# EAGLE design jpwr.v1 (EAGLE 6.2)
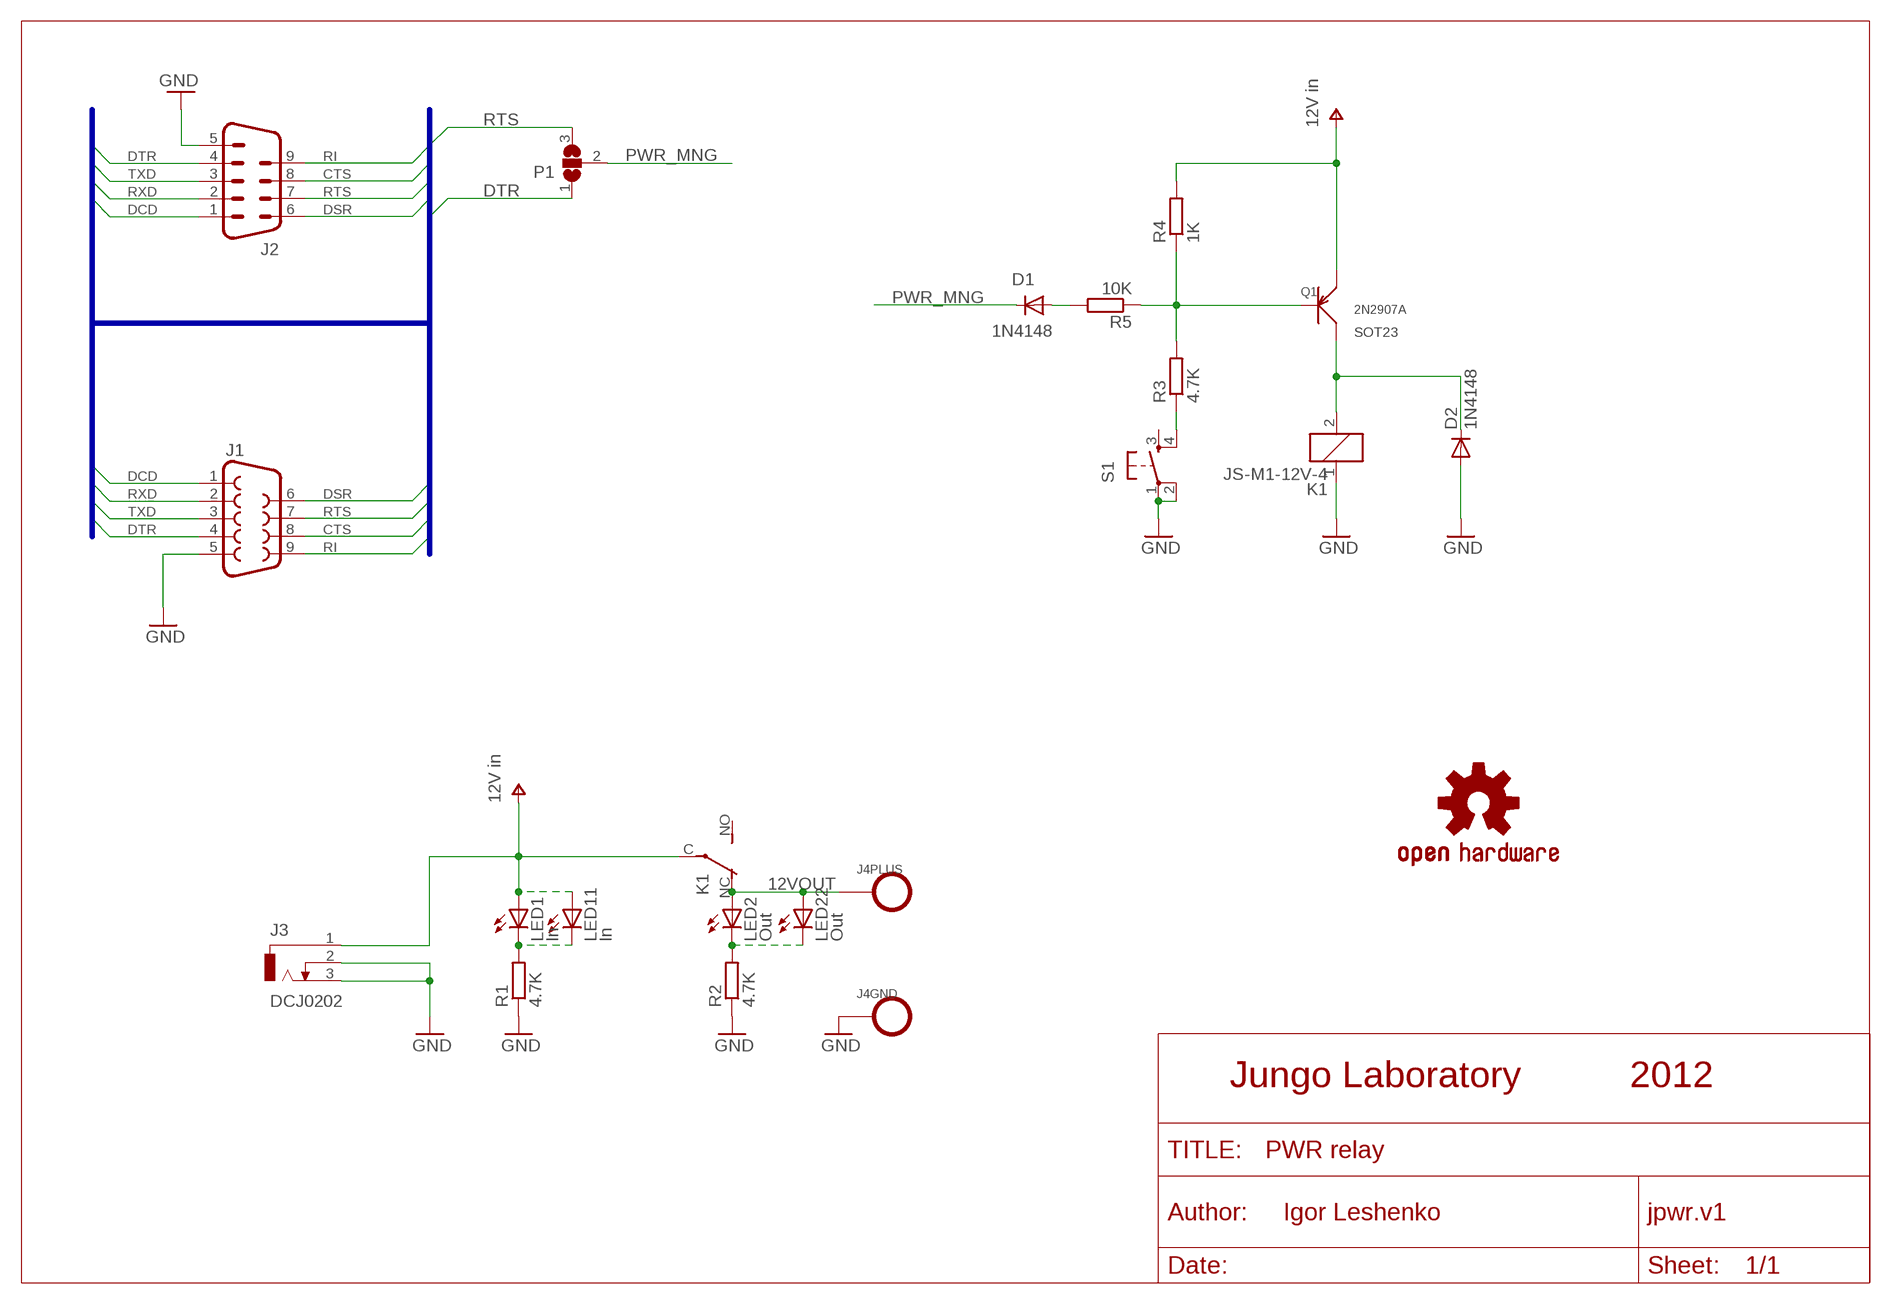
[diagram p0: schematic, sheet 1]

## Parts
D1  1N4148  DIODE-SOD123  [SOD123]
D2  1N4148  DIODE-SOD123  [SOD123]
J1  F09D  [F09D]
J2  M09D  [M09D]
J3  DCJ0202  [DCJ0202]
J4  POWER-OUT  [FLEX-POWER]
K1  JS-M1-12V-4  [SRD]
LED1  In  LEDCHIP-LED0805  [CHIP-LED0805]
LED2  Out  LEDCHIP-LED0805  [CHIP-LED0805]
LED11  In  LEDCHIP-LED0805  [CHIP-LED0805]
LED22  Out  LEDCHIP-LED0805  [CHIP-LED0805]
P1  PAD-SOLDERJUMPER-2WAYT  [3P-SMD-4.8X2]
Q1  2N2907A  TRANSISTOR-PNP-SOT23  [SOT23]
R1  4.7K  R-EU_M0805  [M0805]
R2  4.7K  R-EU_M0805  [M0805]
R3  4.7K  R-EU_M0805  [M0805]
R4  1K  R-EU_M0805  [M0805]
R5  10K  R-EU_M0805  [M0805]
S1  TAC_SWITCHPTH  [TACTILE-PTH]
U$1  OSHW-LOGOL  [OSHW-LOGO-L]

## Nets
12VOUT [power]: J4.1 K1.NC(2:O) LED2.A LED22.A
+12V [power]: J3.1 K1.C(2:P) LED1.A LED11.A Q1.2(E) R4.2 ; supply symbol labelled 12V in
CTS [wires]: J1.8 J2.8
DCD [wires]: J1.1 J2.1
DSR [wires]: J1.6 J2.6
DTR: J1.4 J2.4 P1.1
GND [power]: D2.A J1.5 J2.5 J3.2 J3.3 J4.2 K1.1 R1.1 R2.1 S1.1 S1.2
N$1: R3.1 S1.4
N$8: LED1.C LED11.C R1.2
N$9: LED2.C LED22.C R2.2
N$13: D1.A R5.2
PWR_MNG: D1.C P1.2
Q1_B: Q1.1(B) R3.2 R4.1 R5.1
Q1_C: D2.C K1.2 Q1.3(C)
RI [wires]: J1.9 J2.9
RTS: J1.7 J2.7 P1.3
RXD: J1.2 J2.2
TXD: J1.3 J2.3
Unconnected: K1.NO(2:S) S1.3

## Buses
DCD,RXD,TXD,DTR,DSR,RTS,CTS,RI

## Notes on the sheet
- SOT23
- 2012
- PWR relay
- Igor Leshenko

## Library data of the parts
D1 D2 = diode:DIODE-: DIODE
J1 = con-subd:F09: SUB-D; OC_FARNELL: unknown; OC_NEWARK: unknown
J2 = jlab:M09: SUB-D; OC_FARNELL: unknown; OC_NEWARK: unknown
J3 = con-jack:DCJ0202: DC POWER JACK Source: DCJ0202.pdf; OC_FARNELL: unknown; OC_NEWARK: unknown
J4 = jlab:POWER-OUT
K1 = jlab:JS-M1*: SRD power relayy Source: http://www.spb-planeta.ru/pdf/srd.pdf; MPN: JSM1-12V-4; OC_FARNELL: 910338; OC_NEWARK: 13P4552
LED1 LED2 LED11 LED22 = jlab:LED: LED OSRAM: - CHIPLED LG R971, LG N971, LY N971, LG Q971, LY Q971, LO R971, LY R971 LH N974, LH R974 LS Q976, LO Q976, LY Q976 LO Q996 - Hyper CHIPLED LW Q18S LB Q993, LB Q99A, LB R99A - SideLED LS A670, LO A670, LY A670, LG A670, LP A670 LB A673, LV A673, LT A673, LW A673 LH A674 LY A675 LS A676, LA A676, LO A676, LY A676, LW A676 LS A679, LY A679, LG A679 - Hyper Micro SIDELED® LS Y876, LA Y876, LO Y876, LY Y876 LT Y87S - SmartLED LW L88C, LW L88S LB L89C, LB L89S, LG L890 LS L89K, LO L89K, LY L89K LS L896, LA L896, LO L896, LY L896 - TOPLED LS T670, LO T670, LY T670, LG T670, LP T670 LSG T670, LSP T670, LSY T670, LOP T670, LYG T670 LG T671, LOG T671, LSG T671 LB T673, LV T673, LT T673, LW T673 LH T674 LS T676, LA T676, LO T676, LY T676, LB T676, LH T676, LSB T676, LW T676 LB T67C, LV T67C, LT T67C, LS T67K, LO T67K, LY T67K, LW E67C LS E67B, LA E67B, LO E67B, LY E67B, LB E67C, LV E67C, LT E67C LW T67C LS T679, LY T679, LG T679 LS T770, LO T770, LY T770, LG T770, LP T770 LB T773, LV T773, LT T773, LW T773 LH T774 LS E675, LA E675, LY E675, LS T675 LS T776, LA T776, LO T776, LY T776, LB T776 LHGB T686 LT T68C, LB T68C - Hyper Mini TOPLED® LB M676 - Mini TOPLED Santana® LG M470 LS M47K, LO M47K, LY M47K Source: http://www.osram.convergy.de LUXEON: - LUMILED® LXK2-PW12-R00, LXK2-PW12-S00, LXK2-PW14-U00, LXK2-PW14-V00 LXK2-PM12-R00, LXK2-PM12-S00, LXK2-PM14-U00 LXK2-PE12-Q00, LXK2-PE12-R00, LXK2-PE12-S00, LXK2-PE14-T00, LXK2-PE14-U00 LXK2-PB12-K00, LXK2-PB12-L00, LXK2-PB12-M00, LXK2-PB14-N00, LXK2-PB14-P00, LXK2-PB14-Q00 LXK2-PR12-L00, LXK2-PR12-M00, LXK2-PR14-Q00, LXK2-PR14-R00 LXK2-PD12-Q00, LXK2-PD12-R00, LXK2-PD12-S00 LXK2-PH12-R00, LXK2-PH12-S00 LXK2-PL12-P00, LXK2-PL12-Q00, LXK2-PL12-R00 Source: www.luxeon.com KINGBRIGHT: KA-3528ASYC Source: www.kingbright.com
P1 = Discrete:PAD-SOLDERJUMPER-2WAY: Solder Jumper 2 way solder jumper
Q1 = Discrete:TRANSISTOR-PNP*: PNP audion
R1-R5 = rcl:R-EU_: RESISTOR, European symbol
S1 = SparkFun:TAC_SWITCH: Momentary Switch Button commonly used for reset or general input. Spark Fun Electronics SKU : COM-00097
U$1 = SparkFun:OSHW-LOGO: Open Source Hardware Logo This logo indicates the piece of hardware it is found on incorporates a OSHW license and/or adheres to the definition of open source hardware found here: http://freedomdefined.org/OSHW

## Net classes
0 default: width 0.254 mm, drill 0.5 mm, clearance 0.254 mm
1 power: width 0.813 mm, clearance 0.406 mm
2 wires: width 0.254 mm, clearance 0.254 mm

## Board
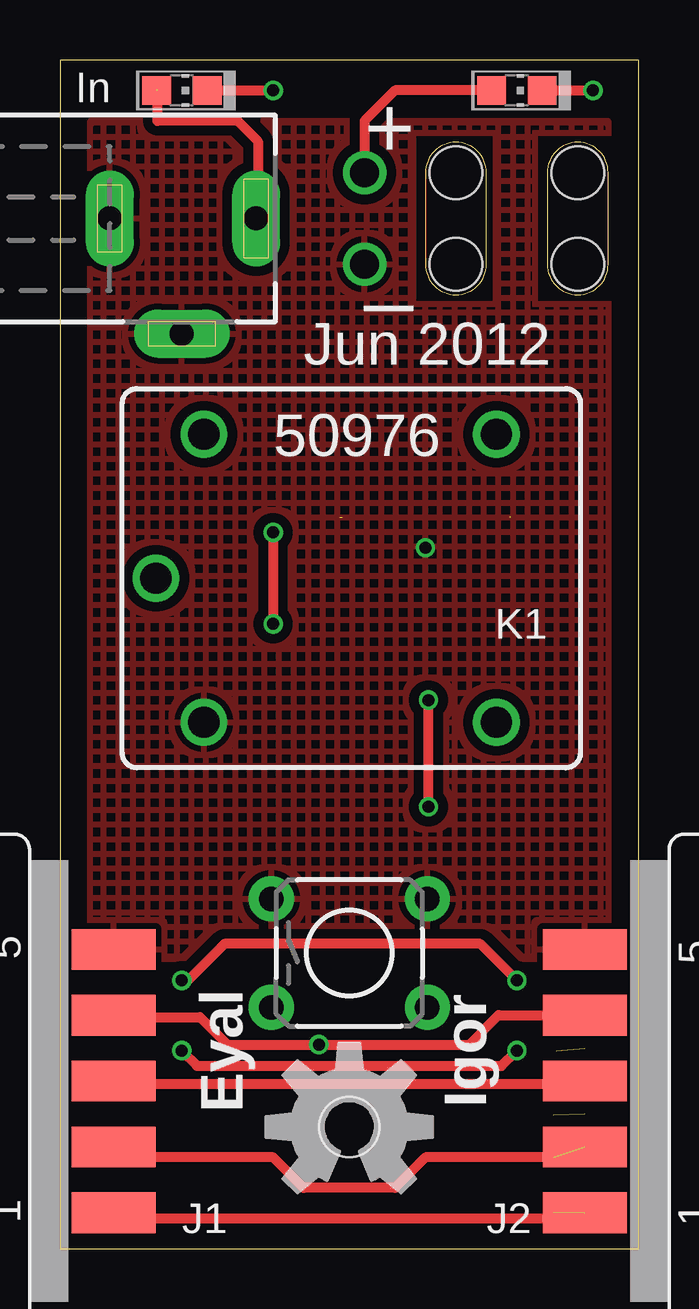
[diagram p1: board, top side]
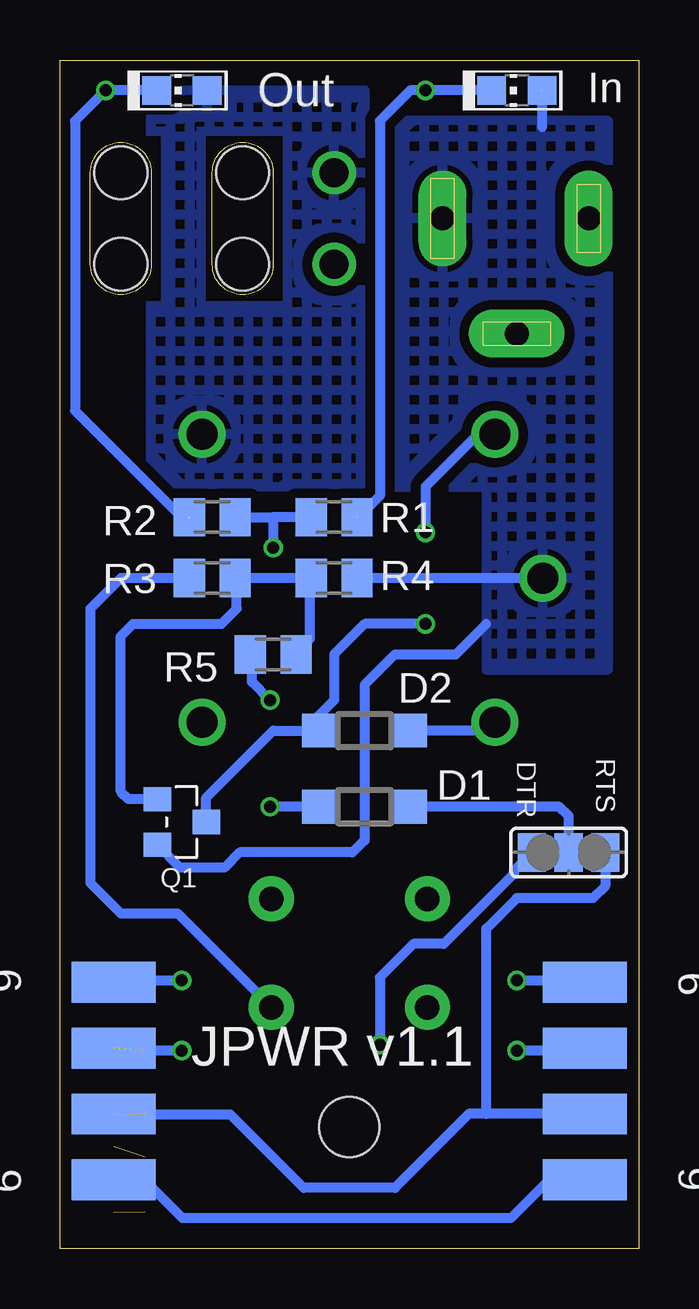
[diagram p2: board, bottom side, seen from below]

Size 24.13 x 49.53 mm. Coordinates in mm from the lower left corner, seen from the top.
Outline: 0,0 24.13,0 24.13,49.53 0,49.53 0,0
Copper layers (1*16): Top 0.035mm / dielectric 1.5mm / Bottom 0.035mm
Design rules: minimum track width 10mil, minimum drill 12mil, track to track 10mil, track to pad 10mil, pad to pad 10mil, via to via 10mil, smd to smd 0mil, copper to edge 10mil, drill to drill 10mil, minimum pad ring 12mil, minimum via ring 6mil, stop-mask expansion 2mil, vias tented up to drill 100mil, thermal gap 10mil
Holes 2.5 mm at 12.06,5.08

### Footprints (pad centres in the part's own frame; a part is rotated, then mirrored left to right if it is on the bottom)
SOD123 = smd 1.4 x 1.4: A 1.9,0; C -1.9,0
F09D = smd 1.7 x 3.5: 1 -5.486,-6.045; 2 -2.743,-6.045; 3 0,-6.045; 4 2.743,-6.045; 5 5.486,-6.045 | smd 1.7 x 3.5 bottom: 6 -4.115,-6.045; 7 -1.372,-6.045; 8 1.372,-6.045; 9 4.115,-6.045
M09D = smd 1.7 x 3.5: 1 5.486,-6.045; 2 2.743,-6.045; 3 0,-6.045; 4 -2.743,-6.045; 5 -5.486,-6.045 | smd 1.7 x 3.5 bottom: 6 4.115,-6.045; 7 1.372,-6.045; 8 -1.372,-6.045; 9 -4.115,-6.045
DCJ0202 = drill 1 pad 2 long: 1 0,3.1; 2 4.8,0; 3 0,-3
FLEX-POWER = drill 1.2: 1 -2.54,1.905; 2 -2.54,-1.905 | hole 2.2: 1.27,1.905; 1.27,-1.905; 6.35,-1.905; 6.35,1.905
SRD = drill 1.3: 1 6.7,6; 2 6.7,-6; C 8.7,0; NC -5.5,-6; NO -5.5,6
CHIP-LED0805 = smd 1.2 x 1.2: A 0,-1.05; C 0,1.05
3P-SMD-4.8X2 = smd 1.168 x 1.6: 1 -1.524,0; 2 0,0; 3 1.524,0
SOT23 = smd 1.016 x 1.143: 1 -0.95,-1.016; 2 0.95,-1.016; 3 0,1.016
M0805 = smd 1.3 x 1.6: 1 -0.95,0; 2 0.95,0
TACTILE-PTH = drill 1.016 pad 1.88: 1 -3.251,2.261; 2 3.251,2.261; 3 -3.251,-2.261; 4 3.251,-2.261

### Placement (x,y rotation side)
D1  11.43,18.41 180 bottom
D2  11.43,21.59 0 bottom
J1  -3.81,6.99 90 top
J2  27.94,6.99 270 top
J3  5.08,42.93 270 top
J4  15.24,42.93 0 top
K1  12.7,27.94 180 top
LED1  5.08,48.26 270 top
LED2  19.05,48.26 270 top
LED11  5.08,48.26 90 bottom
LED22  19.05,48.26 90 bottom
P1  2.92,16.51 0 bottom
Q1  19.05,17.78 270 bottom
R1  12.7,30.48 0 bottom
R2  17.78,30.48 180 bottom
R3  17.78,27.94 0 bottom
R4  12.7,27.94 0 bottom
R5  15.24,24.77 180 bottom
S1  12.06,12.32 0 top
U$1  12.06,5.08 0 top

### Tracks (layer width: path | path; a pad name or v marks a point on that pad's centre or on a via)
12VOUT
  Top 0.406: LED22.A 13.97,48.26 12.7,46.99 J4.1
  pour Bottom (hatched): 11.43,48.26 11.43,31.75 20.32,31.75 20.32,48.26
+12V  (2 unrouted)
  Top 0.406: 8.26,42.93 8.26,46.13 7.4,46.99 4.06,46.99 4.06,48.26
  Bottom 0.406: K1.C R4.2 | LED11.A 4.03,46.74 | Q1.2 19.11,15.88 17.27,15.88 16.64,16.51 11.94,16.51 11.43,17.02 11.43,23.5 10.16,24.77 7.62,24.77 6.35,26.04
  pour Bottom (rank 4, hatched): 1.27,46.99 10.16,46.99 10.16,31.75 6.35,31.75 6.35,24.13 1.27,24.13
CTS  (via drill 0.5)  (1 unrouted)
  Top 0.406: v5.08,8.26 5.71,7.62 18.41,7.62 v19.05,8.26
  Bottom 0.406: J1.8 3.53,8.26 v5.08,8.26 | v19.05,8.26 20.7,8.26
DCD  (1 unrouted)
  Top 0.406: J1.1 3.73,1.27 20.32,1.27 20.57,1.52
DSR
  Bottom 0.254: 3.56,3.05 J1.6
  Bottom 0.406: 3.56,3.05 5.33,1.27 19.02,1.27 20.3,2.54 20.32,2.54 20.65,2.87 J2.6
DTR  (via drill 0.5)
  Top 0.254: 2.23,9.65 J1.4
  Top 0.406: 2.23,9.65 5.84,9.65 6.99,8.51 v10.79,8.51 17.07,8.51 18.29,9.73 J2.4
  Bottom 0.406: P1.1 5.21,15.75 5.21,15.62 8.13,12.7 9.4,12.7 10.79,11.3 v10.79,8.51
GND  (via drill 0.5)
  Bottom 0.406: R2.1 15.24,30.48 | R1.1 15.24,30.48 | 15.24,30.48 v15.24,29.21 | K1.1 6.35,21.59 D2.A
  Bottom 0.813: 13.46,30.73 R1.1
  pour Top (hatched): 1.27,12.06 1.27,46.99 22.86,46.99 22.86,12.06
N$1
  Bottom 0.406: R3.1 21.59,27.94 22.86,26.67 22.86,15.24 21.59,13.97 19.23,13.97 S1.4
N$8  (via drill 0.5)  (1 unrouted)
  Top 0.406: LED11.C v8.89,48.26
  Bottom 0.406: 11.68,30.48 10.79,31.37 10.79,46.99 9.53,48.26 v8.89,48.26 LED11.C
N$9  (via drill 0.5)  (1 unrouted)
  Top 0.406: LED22.C v22.23,48.26
  Bottom 0.406: 18.8,30.48 19.05,30.48 23.5,34.92 23.5,46.99 v22.23,48.26 LED22.C
N$13  (via drill 0.5)
  Top 0.406: v15.37,18.41 v15.37,22.86
  Bottom 0.406: D1.A v15.37,18.41 | v15.37,22.86 16.13,23.62 16.13,24.7 R5.2
PWR_MNG
  Bottom 0.406: P1.2 2.92,18.03 3.3,18.41 D1.C
Q1_B
  Bottom 0.406: 13.72,27.94 13.72,25.4 R5.1 | 13.72,27.94 R3.2 16.76,27.87 16.76,26.67 17.4,26.04 21.08,26.04 21.59,25.53 21.59,19.05 21.27,18.73 Q1.1 | 13.72,27.94 R4.1
Q1_C  (via drill 0.5)
  Top 0.406: v8.89,29.84 v8.89,26.04
  Bottom 0.406: Q1.3 18.03,18.8 15.24,21.59 D2.C 13.34,22.23 12.7,22.86 12.7,24.77 11.43,26.04 v8.89,26.04 | K1.2 6.7,33.94 8.89,31.75 v8.89,29.84
RI  (via drill 0.5)
  Top 0.406: v19.05,11.18 17.53,12.7 6.86,12.7 5.33,11.18 v5.08,11.18
  Bottom 0.254: 3.56,11.18 J1.9 | 20.57,11.18 J2.9
  Bottom 0.406: 20.57,11.18 v19.05,11.18 | v5.08,11.18 3.56,11.18
RTS  (1 unrouted)
  Bottom 0.406: J1.7 6.35,5.61 | 6.35,5.61 7.09,5.61 7.62,5.08 10.16,2.54 13.97,2.54 17.02,5.59 20.57,5.59 | P1.3 1.4,15.11 1.91,14.61 5.08,14.61 6.35,13.34 6.35,5.61
RXD  (1 unrouted)
  Top 0.254: 3.81,3.81 J1.2
  Top 0.406: 3.81,3.81 8.89,3.81 10.16,2.54 13.97,2.54 15.24,3.81 20.57,3.81
TXD
  Top 0.406: J1.3 3.56,6.86 20.57,6.86 J2.3

### Text on the board
tPlace: Jun 2012 | 50976 | Eyal | Igor
bPlace: RTS | DTR
bNames: JPWR v1.1